# EAGLE design PICrouter (EAGLE 6.2)

## Sheet 1 of 3
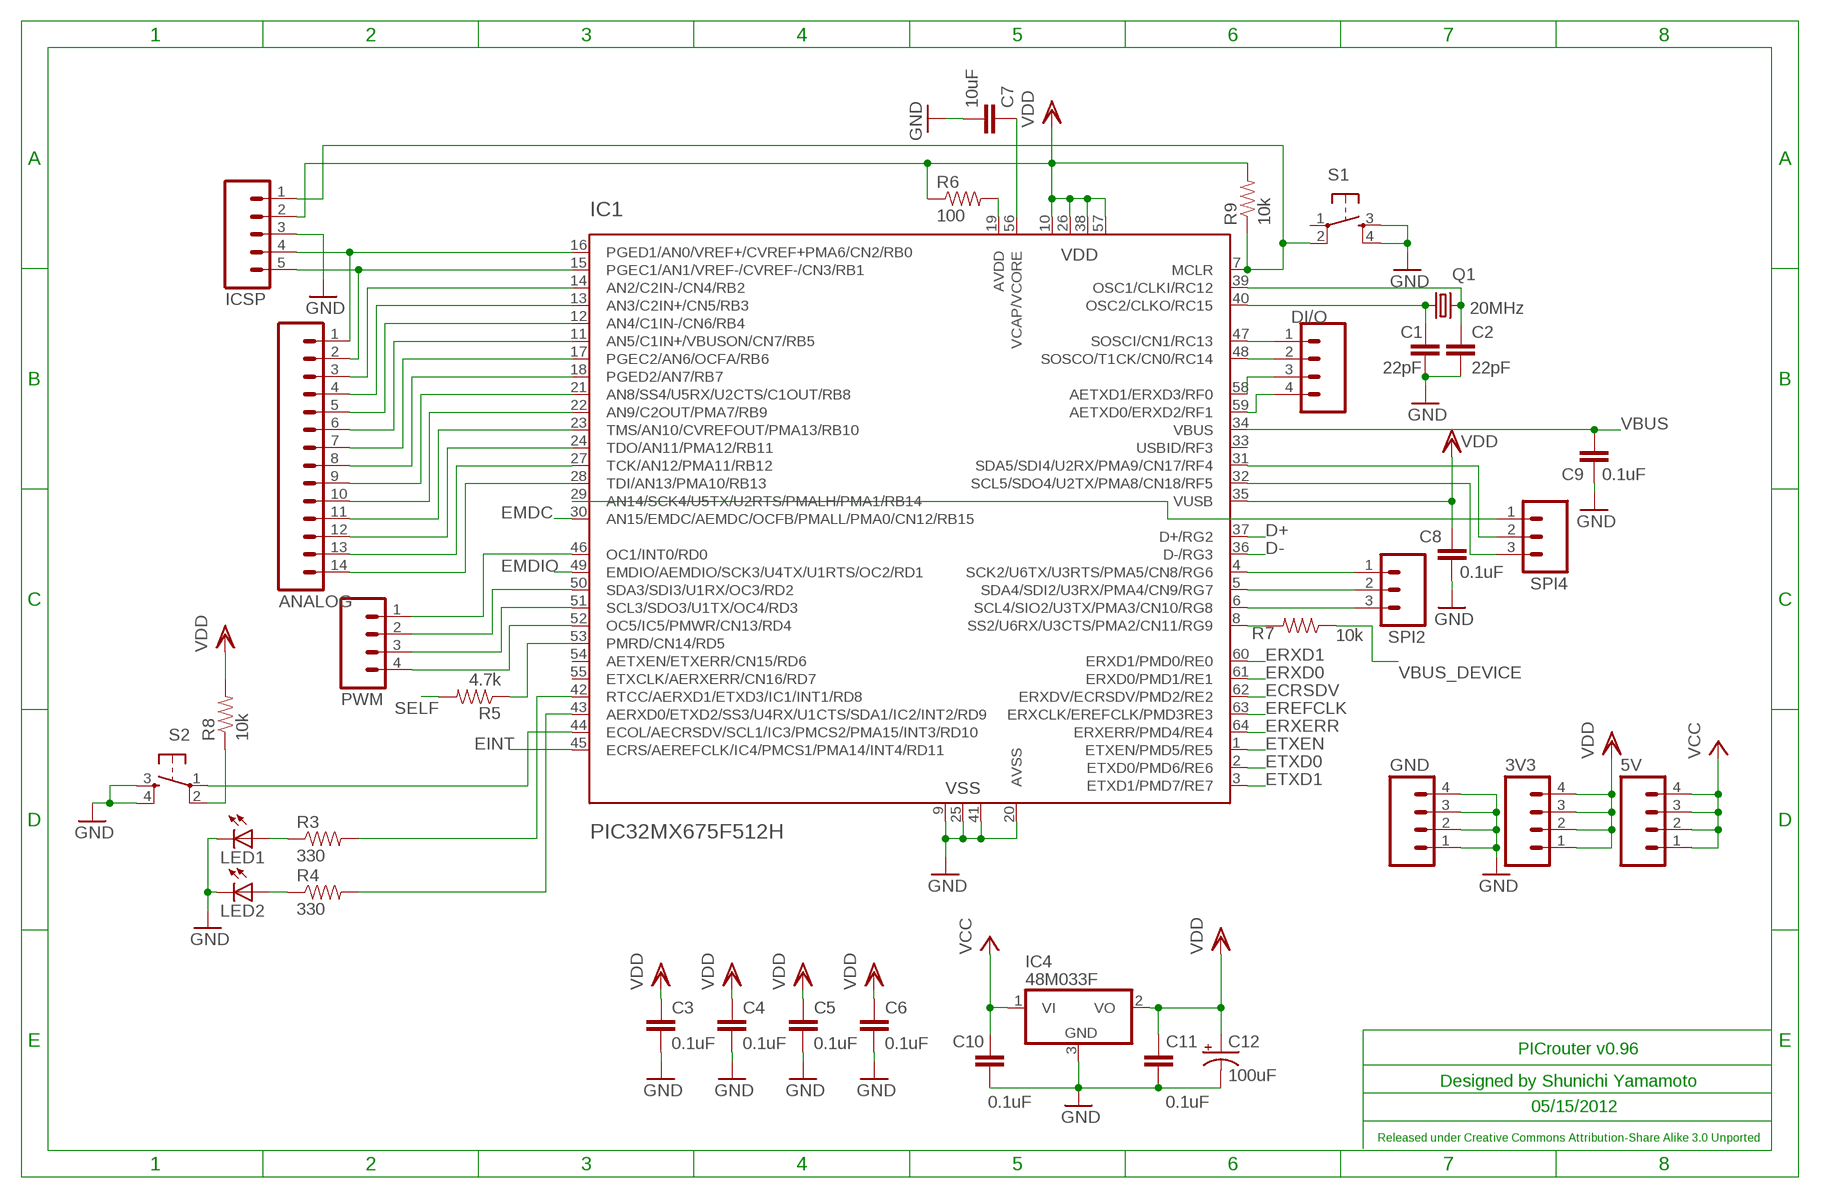
[diagram p0: schematic, sheet 1]

### Parts
3V3  M04PTH  [1X04]
5V  M04PTH  [1X04]
ANALOG  M14  [1X14]
C1  22pF  C-EUC2012  [C2012]
C2  22pF  C-EUC2012  [C2012]
C3  0.1uF  C-EUC2012  [C2012]
C4  0.1uF  C-EUC2012  [C2012]
C5  0.1uF  C-EUC2012  [C2012]
C6  0.1uF  C-EUC2012  [C2012]
C7  10uF  C-EUC2012  [C2012]
C8  0.1uF  C-EUC2012  [C2012]
C9  0.1uF  C-EUC2012  [C2012]
C10  0.1uF  C-EUC2012  [C2012]
C11  0.1uF  C-EUC2012  [C2012]
C12  100uF  CPOL-USC  [PANASONIC_C]
DI/O  M04PTH  [1X04]
GND  M04PTH  [1X04]
IC1  PIC32MX675F512H  [TQFP64-10X10]
IC4  48M033F  7805DT  [TO252]
ICSP  M05PTH  [1X05]
LED1  LEDCHIP-LED0603  [CHIP-LED0603]
LED2  LEDCHIP-LED0603  [CHIP-LED0603]
PWM  M04PTH  [1X04]
Q1  20MHz  CRYSTAL  [CTS406]
R3  330  RESISTOR0603-RES  [0603-RES]
R4  330  RESISTOR0603-RES  [0603-RES]
R5  4.7k  RESISTOR0603-RES  [0603-RES]
R6  100  RESISTOR0603-RES  [0603-RES]
R7  10k  RESISTOR0603-RES  [0603-RES]
R8  10k  RESISTOR0603-RES  [0603-RES]
R9  10k  RESISTOR0603-RES  [0603-RES]
S1  TAC_SWITCHSMD  [TACTILE_SWITCH_SMD]
S2  TAC_SWITCHSMD  [TACTILE_SWITCH_SMD]
SPI2  M03PTH  [1X03]
SPI4  M03PTH  [1X03]

### Nets
D+: IC1.37(D+/RG2) ; also sheet 3
D-: IC1.36(D-/RG3) ; also sheet 3
ECRSDV: IC1.62(ERXDV/ECRSDV/PMD2/RE2) ; also sheet 2
EINT: IC1.45(ECRS/AEREFCLK/IC4/PMCS1/PMA14/INT4/RD11) ; also sheet 2
EMDC: IC1.30(AN15/EMDC/AEMDC/OCFB/PMALL/PMA0/CN12/RB15) ; also sheet 2
EMDIO: IC1.49(EMDIO/AEMDIO/SCK3/U4TX/U1RTS/OC2/RD1) ; also sheet 2
EREFCLK: IC1.63(ERXCLK/EREFCLK/PMD3RE3) ; also sheet 2
ERXD0: IC1.61(ERXD0/PMD1/RE1) ; also sheet 2
ERXD1: IC1.60(ERXD1/PMD0/RE0) ; also sheet 2
ERXERR: IC1.64(ERXERR/PMD4/RE4) ; also sheet 2
ETXD0: IC1.2(ETXD0/PMD6/RE6) ; also sheet 2
ETXD1: IC1.3(ETXD1/PMD7/RE7) ; also sheet 2
ETXEN: IC1.1(ETXEN/PMD5/RE5) ; also sheet 2
GND: C1.2 C2.2 C3.2 C4.2 C5.2 C6.2 C7.2 C8.2 C9.1 C10.2 C11.2 C12.- GND.1 GND.2 GND.3 GND.4 IC1.9(GND) IC1.20(AVSS) IC1.25(GND) IC1.41(GND) IC4.3(GND) ICSP.3 LED1.C LED2.C S1.3 S1.4 S2.3 S2.4 ; also sheet 2,3
N$1: C2.1 IC1.39(OSC1/CLKI/RC12) Q1.3
N$2: C1.1 IC1.40(OSC2/CLKO/RC15) Q1.1
N$3: ANALOG.2 IC1.15(PGEC1/AN1/VREF-/CVREF-/CN3/RB1) ICSP.5
N$4: ANALOG.1 IC1.16(PGED1/AN0/VREF+/CVREF+PMA6/CN2/RB0) ICSP.4
N$6: IC1.7(MCLR) ICSP.1 R9.1 S1.2
N$7: C7.1 IC1.56(VCAP/VCORE)
N$8: R8.1 S2.2
N$10: IC1.19(AVDD) R6.2
N$11: IC1.53(PMRD/CN14/RD5) R5.1
N$12: IC1.8(SS2/U6RX/U3CTS/PMA2/CN11/RG9) R7.2
N$13: IC1.42(RTCC/AERXD1/ETXD3/IC1/INT1/RD8) R3.2
N$14: IC1.43(AERXD0/ETXD2/SS3/U4RX/U1CTS/SDA1/IC2/INT2/RD9) R4.2
N$15: LED1.A R3.1
N$16: LED2.A R4.1
N$17: IC1.44(ECOL/AECRSDV/SCL1/IC3/PMCS2/PMA15/INT3/RD10) S2.1
N$18: ANALOG.3 IC1.14(AN2/C2IN-/CN4/RB2)
N$19: ANALOG.4 IC1.13(AN3/C2IN+/CN5/RB3)
N$20: ANALOG.5 IC1.12(AN4/C1IN-/CN6/RB4)
N$21: ANALOG.6 IC1.11(AN5/C1IN+/VBUSON/CN7/RB5)
N$22: ANALOG.7 IC1.17(PGEC2/AN6/OCFA/RB6)
N$23: ANALOG.8 IC1.18(PGED2/AN7/RB7)
N$24: ANALOG.9 IC1.21(AN8/SS4/U5RX/U2CTS/C1OUT/RB8)
N$25: ANALOG.10 IC1.22(AN9/C2OUT/PMA7/RB9)
N$26: ANALOG.11 IC1.23(TMS/AN10/CVREFOUT/PMA13/RB10)
N$27: ANALOG.12 IC1.24(TDO/AN11/PMA12/RB11)
N$28: ANALOG.13 IC1.27(TCK/AN12/PMA11/RB12)
N$29: ANALOG.14 IC1.28(TDI/AN13/PMA10/RB13)
N$30: IC1.4(SCK2/U6TX/U3RTS/PMA5/CN8/RG6) SPI2.1
N$31: IC1.5(SDA4/SDI2/U3RX/PMA4/CN9/RG7) SPI2.2
N$32: IC1.6(SCL4/SIO2/U3TX/PMA3/CN10/RG8) SPI2.3
N$33: IC1.31(SDA5/SDI4/U2RX/PMA9/CN17/RF4) SPI4.2
N$34: IC1.32(SCL5/SDO4/U2TX/PMA8/CN18/RF5) SPI4.3
N$35: IC1.29(AN14/SCK4/U5TX/U2RTS/PMALH/PMA1/RB14) SPI4.1
N$36: IC1.46(OC1/INT0/RD0) PWM.1
N$37: DI/O.1 IC1.47(SOSCI/CN1/RC13)
N$38: IC1.50(SDA3/SDI3/U1RX/OC3/RD2) PWM.2
N$39: IC1.51(SCL3/SDO3/U1TX/OC4/RD3) PWM.3
N$40: IC1.52(OC5/IC5/PMWR/CN13/RD4) PWM.4
N$41: DI/O.2 IC1.48(SOSCO/T1CK/CN0/RC14)
N$42: DI/O.3 IC1.58(AETXD1/ERXD3/RF0)
N$43: DI/O.4 IC1.59(AETXD0/ERXD2/RF1)
SELF: R5.2 ; also sheet 3
VBUS: C9.2 IC1.34(VBUS) ; also sheet 3
VBUS_DEVICE: R7.1 ; also sheet 3
VCC: 5V.1 5V.2 5V.3 5V.4 C10.1 IC4.1(VI) ; also sheet 3
VDD: 3V3.1 3V3.2 3V3.3 3V3.4 C3.1 C4.1 C5.1 C6.1 C8.1 C11.1 C12.+ IC1.10(VDD) IC1.26(VDD) IC1.35(VUSB) IC1.38(VDD) IC1.57(VDD) IC4.2(VO) ICSP.2 R6.1 R8.2 R9.2 ; also sheet 2
Unconnected: IC1.33(USBID/RF3) IC1.54(AETXEN/ETXERR/CN15/RD6) IC1.55(ETXCLK/AERXERR/CN16/RD7) S1.1

### Notes on the sheet
- PICrouter v0.96
- Designed by Shunichi Yamamoto
- 05/15/2012
- Released under Creative Commons Attribution-Share Alike 3.0 Unported

## Sheet 2 of 3
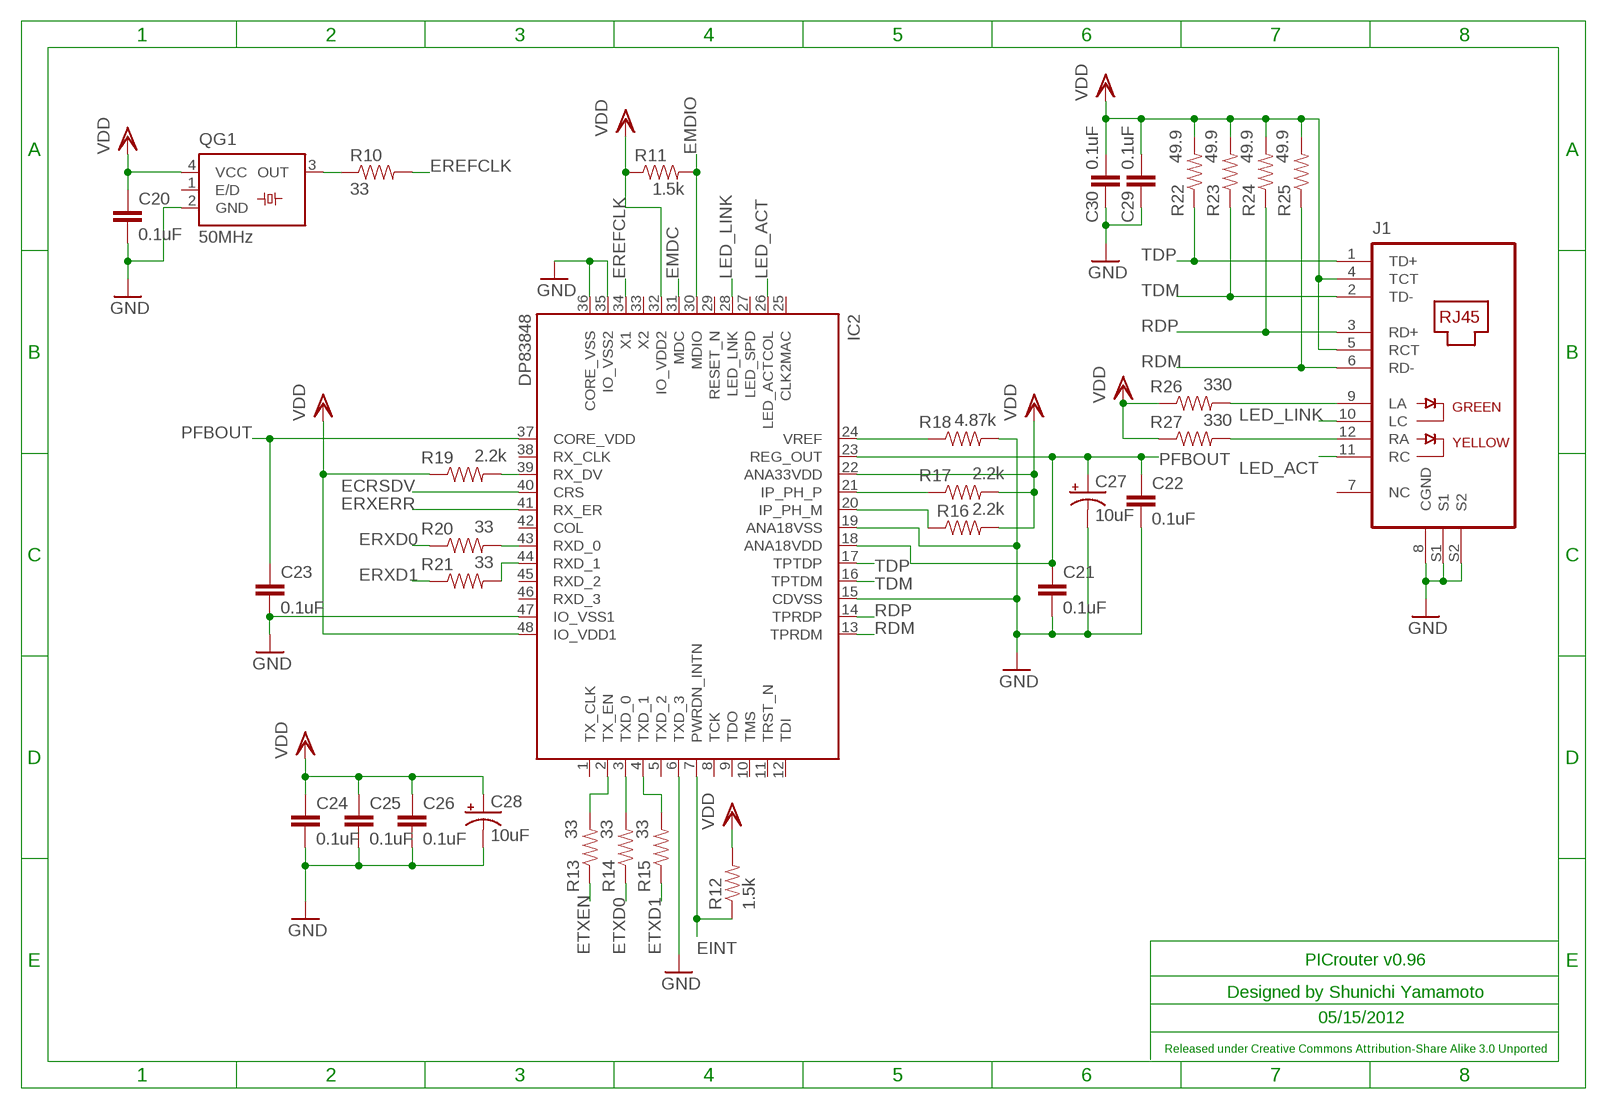
[diagram p1: schematic, sheet 2]

### Parts
C20  0.1uF  C-EUC2012  [C2012]
C21  0.1uF  C-EUC2012  [C2012]
C22  0.1uF  C-EUC2012  [C2012]
C23  0.1uF  C-EUC2012  [C2012]
C24  0.1uF  C-EUC2012  [C2012]
C25  0.1uF  C-EUC2012  [C2012]
C26  0.1uF  C-EUC2012  [C2012]
C27  10uF  CAP_POL6032  [EIA6032]
C28  10uF  CPOL-USC  [PANASONIC_C]
C29  0.1uF  C-EUC2012  [C2012]
C30  0.1uF  C-EUC2012  [C2012]
IC2  DP83848  [LQFP48]
J1  J0011  [PJ-J0]
QG1  50MHz  SM77H  [SM77H]
R10  33  RESISTOR0603-RES  [0603-RES]
R11  1.5k  RESISTOR0603-RES  [0603-RES]
R12  1.5k  RESISTOR0603-RES  [0603-RES]
R13  33  RESISTOR0603-RES  [0603-RES]
R14  33  RESISTOR0603-RES  [0603-RES]
R15  33  RESISTOR0603-RES  [0603-RES]
R16  2.2k  RESISTOR0603-RES  [0603-RES]
R17  2.2k  RESISTOR0603-RES  [0603-RES]
R18  4.87k  RESISTOR0603-RES  [0603-RES]
R19  2.2k  RESISTOR0603-RES  [0603-RES]
R20  33  RESISTOR0603-RES  [0603-RES]
R21  33  RESISTOR0603-RES  [0603-RES]
R22  49.9  RESISTOR0603-RES  [0603-RES]
R23  49.9  RESISTOR0603-RES  [0603-RES]
R24  49.9  RESISTOR0603-RES  [0603-RES]
R25  49.9  RESISTOR0603-RES  [0603-RES]
R26  330  RESISTOR0603-RES  [0603-RES]
R27  330  RESISTOR0603-RES  [0603-RES]

### Nets
ECRSDV: IC2.40(CRS) ; also sheet 1
EINT: IC2.7(PWRDN_INTN) R12.1 ; also sheet 1
EMDC: IC2.31(MDC) ; also sheet 1
EMDIO: IC2.30(MDIO) R11.2 ; also sheet 1
EREFCLK: IC2.34(X1) R10.2 ; also sheet 1
ERXD0: R20.1 ; also sheet 1
ERXD1: R21.1 ; also sheet 1
ERXERR: IC2.41(RX_ER) ; also sheet 1
ETXD0: R14.1 ; also sheet 1
ETXD1: R15.1 ; also sheet 1
ETXEN: R13.1 ; also sheet 1
GND: C20.2 C21.2 C22.2 C23.2 C24.2 C25.2 C26.2 C27.P$2(-) C28.- C29.2 C30.2 IC2.6(TXD_3) IC2.15(CDVSS) IC2.19(ANA18VSS) IC2.35(IO_VSS2) IC2.36(CORE_VSS) IC2.47(IO_VSS1) J1.8(CGND) J1.S1 J1.S2 QG1.2(GND) R18.2 ; also sheet 1,3
LED_ACT: IC2.26(LED_ACTCOL) J1.11(RC)
LED_LINK: IC2.28(LED_LNK) J1.10(LC)
N$9: IC2.24(VREF) R18.1
N$47: IC2.21(IP_PH_P) R17.1
N$48: IC2.20(IP_PH_M) R16.1
N$49: IC2.39(RX_DV) R19.2
N$52: IC2.4(TXD_1) R15.2
N$53: IC2.3(TXD_0) R14.2
N$54: IC2.2(TX_EN) R13.2
N$55: J1.9(LA) R26.2
N$56: IC2.43(RXD_0) R20.2
N$57: IC2.44(RXD_1) R21.2
N$58: QG1.3(OUT) R10.1
N$62: J1.12(RA) R27.2
PFBOUT: C21.1 C22.1 C23.1 C27.P$1(+) IC2.18(ANA18VDD) IC2.23(REG_OUT) IC2.37(CORE_VDD)
RDM: IC2.13(TPRDM) J1.6(RD-) R25.1
RDP: IC2.14(TPRDP) J1.3(RD+) R24.1
TDM: IC2.16(TPTDM) J1.2(TD-) R23.1
TDP: IC2.17(TPTDP) J1.1(TD+) R22.1
VDD: C20.1 C24.1 C25.1 C26.1 C28.+ C29.1 C30.1 IC2.22(ANA33VDD) IC2.32(IO_VDD2) IC2.48(IO_VDD1) J1.4(TCT) J1.5(RCT) QG1.4(VCC) R11.1 R12.2 R16.2 R17.2 R19.1 R22.2 R23.2 R24.2 R25.2 R26.1 R27.1 ; also sheet 1
Unconnected: IC2.1(TX_CLK) IC2.5(TXD_2) IC2.8(TCK) IC2.9(TDO) IC2.10(TMS) IC2.11(TRST_N) IC2.12(TDI) IC2.25(CLK2MAC) IC2.27(LED_SPD) IC2.29(RESET_N) IC2.33(X2) IC2.38(RX_CLK) IC2.42(COL) IC2.45(RXD_2) IC2.46(RXD_3) J1.7(NC) QG1.1(E/D)

### Notes on the sheet
- PICrouter v0.96
- Designed by Shunichi Yamamoto
- 05/15/2012
- Released under Creative Commons Attribution-Share Alike 3.0 Unported

## Sheet 3 of 3
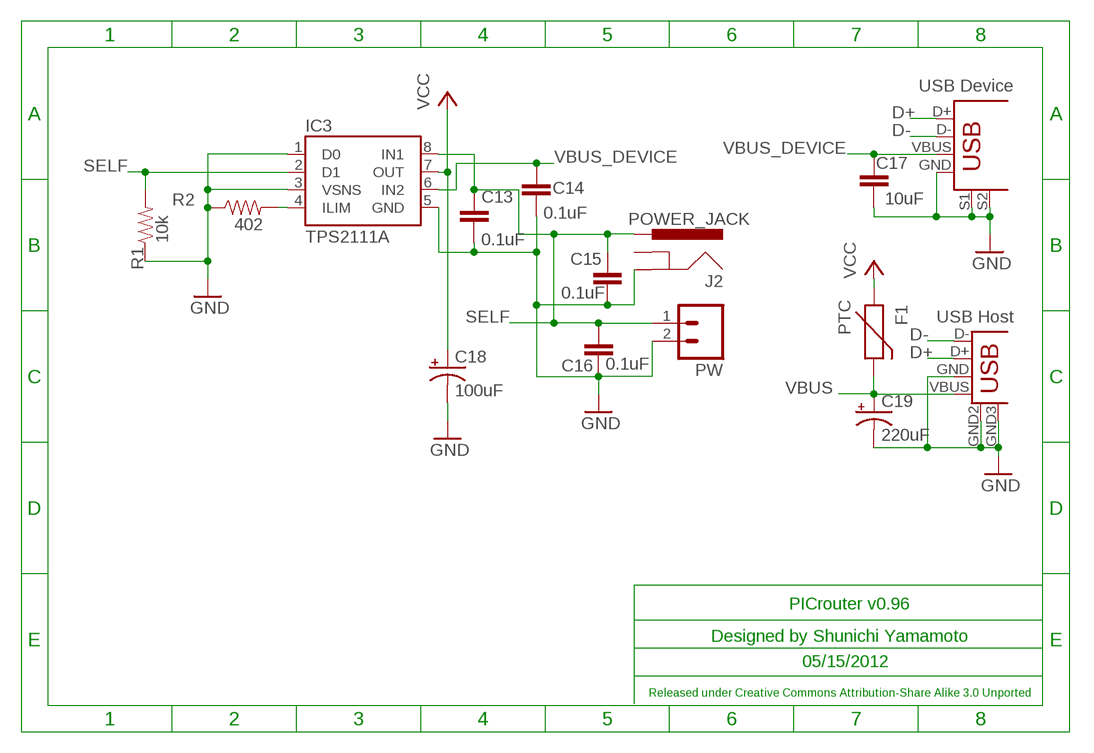
[diagram p2: schematic, sheet 3]

### Parts
C13  0.1uF  C-EUC2012  [C2012]
C14  0.1uF  C-EUC2012  [C2012]
C15  0.1uF  C-EUC2012  [C2012]
C16  0.1uF  C-EUC2012  [C2012]
C17  10uF  C-EUC2012  [C2012]
C18  100uF  CPOL-USC  [PANASONIC_C]
C19  220uF  CPOL-USD  [PANASONIC_D]
F1  PTC  PTCSMD  [PTC-1206]
IC3  TPS2111A  [TSSOP8]
J2  POWER_JACK  POWER_JACKPTH_LOCK  [POWER_JACK_PTH_LOCK]
PW  M02PTH  [1X02]
R1  10k  RESISTOR0603-RES  [0603-RES]
R2  402  RESISTOR0603-RES  [0603-RES]
U2  DEVICE  USB+SHIELD  [USB-B-PTH]
X2  USB-A-H  [USB-A-H]

### Nets
D+: U2.D+ X2.D+ ; also sheet 1
D-: U2.D- X2.D- ; also sheet 1
GND: C13.2 C14.2 C15.2 C16.2 C17.2 C18.- C19.- IC3.1(D0) IC3.3(VSNS) IC3.5(GND) J2.GND PW.2 R1.1 R2.1 U2.GND U2.S1 U2.S2 X2.GND X2.GND2(S1) X2.GND3(S2) ; also sheet 1,2
N$61: IC3.4(ILIM) R2.2
SELF: C13.1 C15.1 C16.1 IC3.2(D1) IC3.8(IN1) J2.PWR PW.1 R1.2 ; also sheet 1
VBUS: C19.+ F1.2 X2.VBUS ; also sheet 1
VBUS_DEVICE: C14.1 C17.1 IC3.6(IN2) U2.VBUS ; also sheet 1
VCC: C18.+ F1.1 IC3.7(OUT) ; also sheet 1
Unconnected: J2.GNDBREAK

### Notes on the sheet
- USB Device
- USB Host
- PICrouter v0.96
- Designed by Shunichi Yamamoto
- 05/15/2012
- Released under Creative Commons Attribution-Share Alike 3.0 Unported

## Library data of the parts
3V3 5V DI/O GND PWM = SparkFun:M04: Header 4 Standard 4-pin 0.1" header. Use with straight break away headers (SKU : PRT-00116), right angle break away headers (PRT-00553), swiss pins (PRT-00743), machine pins (PRT-00117), and female headers (PRT-00115). Molex polarized connector foot print use with SKU : PRT-08231 with associated crimp pins and housings. 1MM SMD Version SKU: PRT-10208
ANALOG = SparkFun:M14: Header 14 Standard 14-pin 0.1" header. Use with straight break away headers (SKU : PRT-00116), right angle break away headers (PRT-00553), swiss pins (PRT-00743), machine pins (PRT-00117), and female headers (PRT-00115).
C1-C11 C13-C17 C20-C26 C29 C30 = rcl:C-EU: CAPACITOR, European symbol
C12 C18 C19 C28 = rcl:CPOL-US: POLARIZED CAPACITOR, American symbol
C27 = SparkFun:CAP_POL: Capacitor Polarized These are standard SMD and PTH capacitors. Normally 10uF, 47uF, and 100uF in electrolytic and tantalum varieties. Always verify the external diameter of the through hole cap, it varies with capacity, voltage, and manufacturer. The EIA devices should be standard.
F1 = SparkFun:PTC: Resettable Fuse PTC Resettable Fuse. Spark Fun Electronics SKU : COM-08357
IC1 = PIC.rpt:PIC32MX675F512H: Microchip PIC32 USB
IC2 = national-semiconductor:DP83848: PHYTER® - Extended Temperature Single Port 10/100 Mb/s Ethernet Physical Layer Transceiver Auto generated by make-symbol-device-package-bsdl.ulp Rev. 34 Source: dp83848yb.bsdl http://www.national.com/ds/DP/DP83848VYB.pdf; MPN: DP83848VYB; OC_FARNELL: 1286817; OC_NEWARK: 11N4484
IC3 = SparkFun:TPS2111A
IC4 = linear:78*: Positive VOLTAGE REGULATOR Source: http://cache.national.com/ds/LM/LM78L05.pdf http://www.fairchildsemi.com/ds/LM/LM7805.pdf
ICSP = SparkFun:M05: Header 5 Standard 5-pin 0.1" header. Use with straight break away headers (SKU : PRT-00116), right angle break away headers (PRT-00553), swiss pins (PRT-00743), machine pins (PRT-00117), and female headers (PRT-00115). Molex polarized connector foot print use with SKU : PRT-08230 with associated crimp pins and housings.
J1 = pulse_j0011:J0011: RJ45 PulseJack w/LEDs
J2 = SparkFun:POWER_JACK: Power Jack This is the standard 5.5mm barrel jack for power. The PTH is the most common, proven, reliable, footprint. All others are experimental. The Slot footprint only works if the mill layer is transmitted to the PCB fab house so be warned. Spark Fun Electronics SKU : PRT-00119. Mating wall wart : TOL-00298 (and others)
LED1 LED2 = led:LED: LED OSRAM: - CHIPLED LG R971, LG N971, LY N971, LG Q971, LY Q971, LO R971, LY R971 LH N974, LH R974 LS Q976, LO Q976, LY Q976 LO Q996 - Hyper CHIPLED LW Q18S LB Q993, LB Q99A, LB R99A - SideLED LS A670, LO A670, LY A670, LG A670, LP A670 LB A673, LV A673, LT A673, LW A673 LH A674 LY A675 LS A676, LA A676, LO A676, LY A676, LW A676 LS A679, LY A679, LG A679 - Hyper Micro SIDELED® LS Y876, LA Y876, LO Y876, LY Y876 LT Y87S - SmartLED LW L88C, LW L88S LB L89C, LB L89S, LG L890 LS L89K, LO L89K, LY L89K LS L896, LA L896, LO L896, LY L896 - TOPLED LS T670, LO T670, LY T670, LG T670, LP T670 LSG T670, LSP T670, LSY T670, LOP T670, LYG T670 LG T671, LOG T671, LSG T671 LB T673, LV T673, LT T673, LW T673 LH T674 LS T676, LA T676, LO T676, LY T676, LB T676, LH T676, LSB T676, LW T676 LB T67C, LV T67C, LT T67C, LS T67K, LO T67K, LY T67K, LW E67C LS E67B, LA E67B, LO E67B, LY E67B, LB E67C, LV E67C, LT E67C LW T67C LS T679, LY T679, LG T679 LS T770, LO T770, LY T770, LG T770, LP T770 LB T773, LV T773, LT T773, LW T773 LH T774 LS E675, LA E675, LY E675, LS T675 LS T776, LA T776, LO T776, LY T776, LB T776 LHGB T686 LT T68C, LB T68C - Hyper Mini TOPLED® LB M676 - Mini TOPLED Santana® LG M470 LS M47K, LO M47K, LY M47K Source: http://www.osram.convergy.de LUXEON: - LUMILED® LXK2-PW12-R00, LXK2-PW12-S00, LXK2-PW14-U00, LXK2-PW14-V00 LXK2-PM12-R00, LXK2-PM12-S00, LXK2-PM14-U00 LXK2-PE12-Q00, LXK2-PE12-R00, LXK2-PE12-S00, LXK2-PE14-T00, LXK2-PE14-U00 LXK2-PB12-K00, LXK2-PB12-L00, LXK2-PB12-M00, LXK2-PB14-N00, LXK2-PB14-P00, LXK2-PB14-Q00 LXK2-PR12-L00, LXK2-PR12-M00, LXK2-PR14-Q00, LXK2-PR14-R00 LXK2-PD12-Q00, LXK2-PD12-R00, LXK2-PD12-S00 LXK2-PH12-R00, LXK2-PH12-S00 LXK2-PL12-P00, LXK2-PL12-Q00, LXK2-PL12-R00 Source: www.luxeon.com KINGBRIGHT: KA-3528ASYC Source: www.kingbright.com
PW = SparkFun:M02: Header 2 Standard 2-pin 0.1" header. Use with straight break away headers (SKU : PRT-00116), right angle break away headers (PRT-00553), swiss pins (PRT-00743), machine pins (PRT-00117), and female headers (PRT-00115). Molex polarized connector foot print use with SKU : PRT-08233 with associated crimp pins and housings.
Q1 = my-crystal:CRYSTAL: CRYSTAL
QG1 = my-crystal:SM77H: 3.3V CMOS Clock Oscillator Source: www.pletronics.com .. sm77h%203.3v.pdf; OC_FARNELL: unknown; OC_NEWARK: unknown
R1-R27 = SparkFun:RESISTOR: Resistor Basic schematic elements and footprints for 0603, 1206, and PTH resistors.
S1 S2 = SparkFun:TAC_SWITCH: Momentary Switch Button commonly used for reset or general input. Spark Fun Electronics SKU : COM-00097
SPI2 SPI4 = SparkFun:M03: Header 3 Standard 3-pin 0.1" header. Use with straight break away headers (SKU : PRT-00116), right angle break away headers (PRT-00553), swiss pins (PRT-00743), machine pins (PRT-00117), and female headers (PRT-00115). Molex polarized connector foot print use with SKU : PRT-08232 with associated crimp pins and housings.
U2 = SparkFun:USB+SHIELD: USB+Shield USB connector with shield pins connectable
X2 = SparkFun:USB: USB Connectors USB-B-PTH is fully proven SKU : PRT-00139 USB-miniB is fully proven SKU : PRT-00587 USB-A-PCB is untested. USB-A-H is throughly reviewed, but untested. Spark Fun Electronics SKU : PRT-00437 USB-B-SMT is throughly reviewed, but untested. Needs silkscreen touching up. USB-A-S has not been used/tested USB-MB-H has not been used/tested

## Board
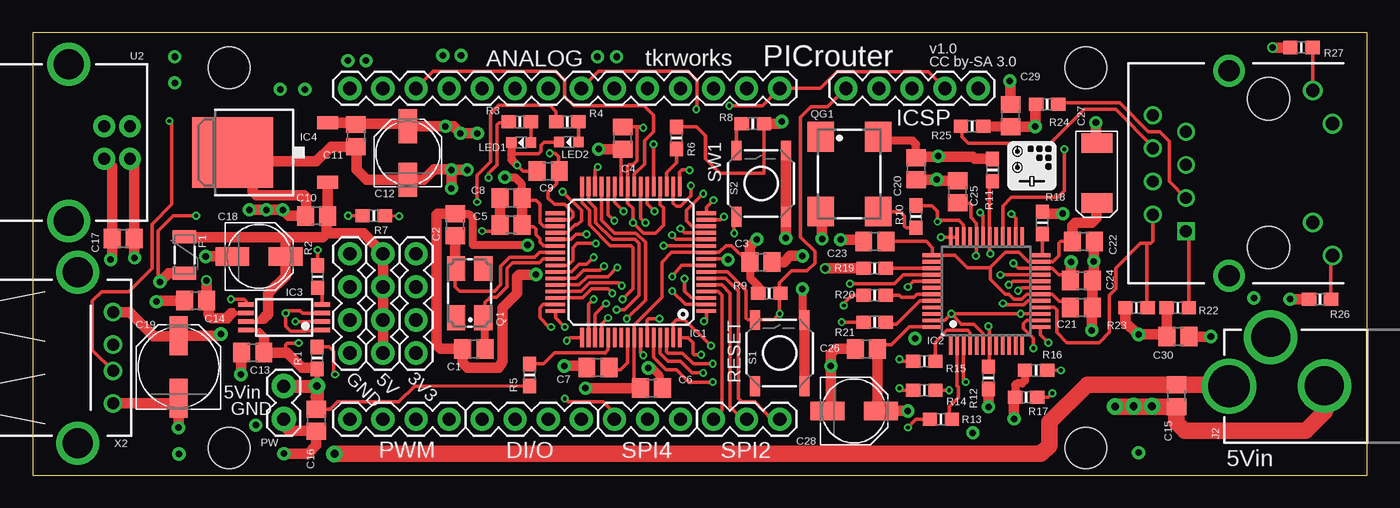
[diagram p3: board, top side]
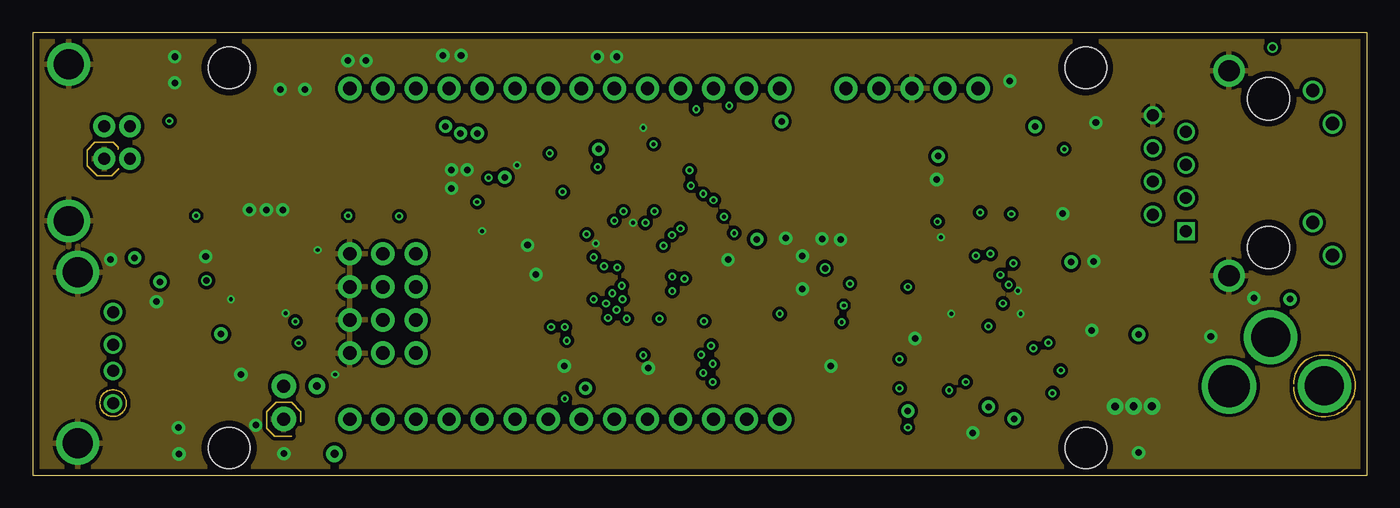
[diagram p4: board, inner layer GND]
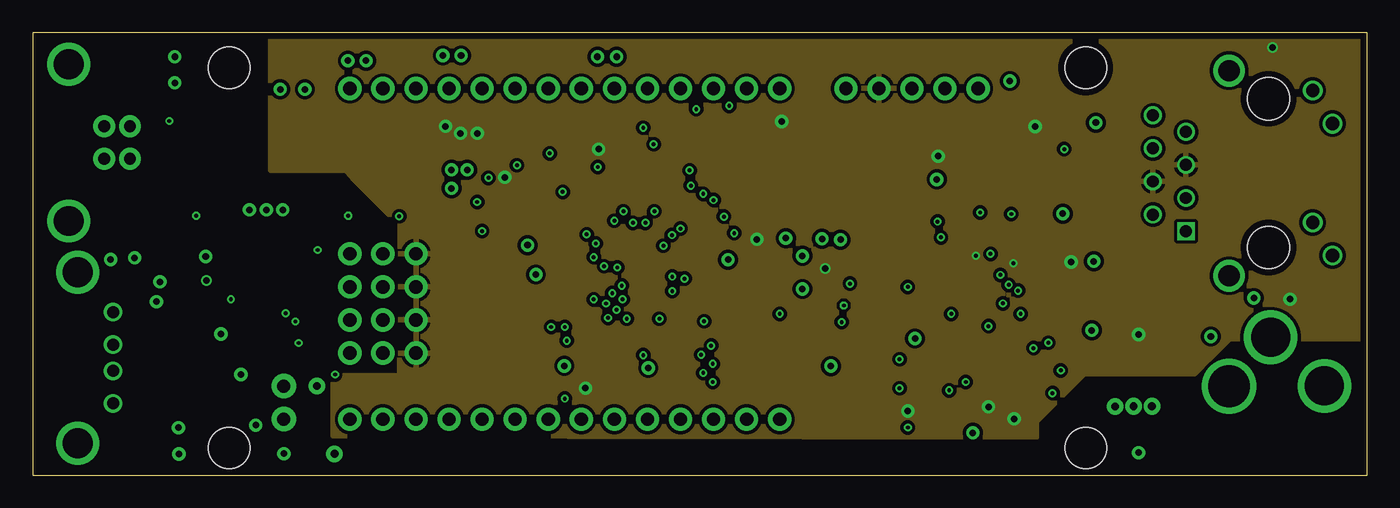
[diagram p5: board, inner layer VDD]
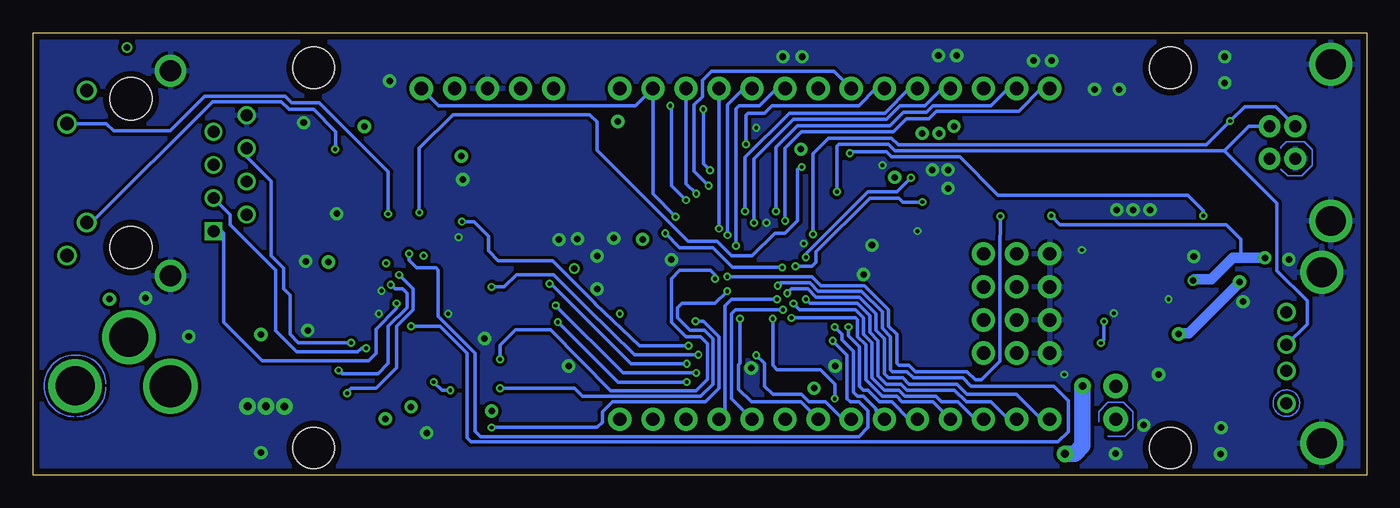
[diagram p6: board, bottom side, seen from below]

Size 102.5 x 34 mm. Coordinates in mm from the lower left corner, seen from the top.
Outline: 102.5,34 0,34 0,0 102.5,0 102.5,34
Copper layers (1+2*15+16): Top 0.018mm / dielectric 0.25mm / GND 0.035mm / dielectric 1mm / Route15 0.035mm / dielectric 0.25mm / Bottom 0.018mm
Design rules: minimum track width 5mil, minimum drill 0.3mm, track to track 5mil, track to pad 0.229mm, pad to pad 5mil, via to via 5mil, smd to smd 5mil, copper to edge 0.5mm, drill to drill 0.5mm, minimum pad ring 0.15mm, minimum via ring 0.15mm, stop-mask expansion 4mil, vias tented up to drill 0.35mm, thermal gap 10mil
Holes 3.2 mm at 15.1,31.3 15.1,2.1 80.9,2.1 80.9,31.3

### Footprints (pad centres in the part's own frame; a part is rotated, then mirrored left to right if it is on the bottom)
1X04 = drill 1.016 pad 1.778: 1 0,0; 2 2.54,0; 3 5.08,0; 4 7.62,0
1X14 = drill 1.016 pad 1.778: 1 0,0; 2 2.54,0; 3 5.08,0; 4 7.62,0; 5 10.16,0; 6 12.7,0; 7 15.24,0; 8 17.78,0; 9 20.32,0; 10 22.86,0; 11 25.4,0; 12 27.94,0; 13 30.48,0; 14 33.02,0
C2012 = smd 1.3 x 1.5: 1 -0.85,0; 2 0.85,0
PANASONIC_C = smd 2.6 x 1.4: + 2.05,0; - -2.05,0
PANASONIC_D = smd 3 x 1.4: + 2.4,0; - -2.4,0
EIA6032 = smd 1.5 x 2.4: P$1 -2.3,0; P$2 2.3,0
PTC-1206 = smd 1 x 1.8: 1 -1.4,0; 2 1.4,0
TQFP64-10X10 = smd 1.5 x 0.28: 1 -5.8,3.75; 2 -5.8,3.25; 3 -5.8,2.75; 4 -5.8,2.25; 5 -5.8,1.75; 6 -5.8,1.25; 7 -5.8,0.75; 8 -5.8,0.25; 9 -5.8,-0.25; 10 -5.8,-0.75; 11 -5.8,-1.25; 12 -5.8,-1.75; 13 -5.8,-2.25; 14 -5.8,-2.75; 15 -5.8,-3.25; 16 -5.8,-3.75; 33 5.8,-3.75; 34 5.8,-3.25; 35 5.8,-2.75; 36 5.8,-2.25; 37 5.8,-1.75; 38 5.8,-1.25; 39 5.8,-0.75; 40 5.8,-0.25; 41 5.8,0.25; 42 5.8,0.75; 43 5.8,1.25; 44 5.8,1.75; 45 5.8,2.25; 46 5.8,2.75; 47 5.8,3.25; 48 5.8,3.75 | smd 0.28 x 1.5: 17 -3.75,-5.8; 18 -3.25,-5.8; 19 -2.75,-5.8; 20 -2.25,-5.8; 21 -1.75,-5.8; 22 -1.25,-5.8; 23 -0.75,-5.8; 24 -0.25,-5.8; 25 0.25,-5.8; 26 0.75,-5.8; 27 1.25,-5.8; 28 1.75,-5.8; 29 2.25,-5.8; 30 2.75,-5.8; 31 3.25,-5.8; 32 3.75,-5.8; 49 3.75,5.8; 50 3.25,5.8; 51 2.75,5.8; 52 2.25,5.8; 53 1.75,5.8; 54 1.25,5.8; 55 0.75,5.8; 56 0.25,5.8; 57 -0.25,5.8; 58 -0.75,5.8; 59 -1.25,5.8; 60 -1.75,5.8; 61 -2.25,5.8; 62 -2.75,5.8; 63 -3.25,5.8; 64 -3.75,5.8
LQFP48 = smd 1.5 x 0.279: 1 -4.15,2.75; 2 -4.15,2.25; 3 -4.15,1.75; 4 -4.15,1.25; 5 -4.15,0.75; 6 -4.15,0.25; 7 -4.15,-0.25; 8 -4.15,-0.75; 9 -4.15,-1.25; 10 -4.15,-1.75; 11 -4.15,-2.25; 12 -4.15,-2.75; 25 4.15,-2.75; 26 4.15,-2.25; 27 4.15,-1.75; 28 4.15,-1.25; 29 4.15,-0.75; 30 4.15,-0.25; 31 4.15,0.25; 32 4.15,0.75; 33 4.15,1.25; 34 4.15,1.75; 35 4.15,2.25; 36 4.15,2.75 | smd 0.279 x 1.5: 13 -2.75,-4.15; 14 -2.25,-4.15; 15 -1.75,-4.15; 16 -1.25,-4.15; 17 -0.75,-4.15; 18 -0.25,-4.15; 19 0.25,-4.15; 20 0.75,-4.15; 21 1.25,-4.15; 22 1.75,-4.15; 23 2.25,-4.15; 24 2.75,-4.15; 37 2.75,4.15; 38 2.25,4.15; 39 1.75,4.15; 40 1.25,4.15; 41 0.75,4.15; 42 0.25,4.15; 43 -0.25,4.15; 44 -0.75,4.15; 45 -1.25,4.15; 46 -1.75,4.15; 47 -2.25,4.15; 48 -2.75,4.15
TSSOP8 = smd 1.2 x 0.35: 1 -2.925,0.975; 2 -2.925,0.325; 3 -2.925,-0.325; 4 -2.925,-0.975; 5 2.925,-0.975; 6 2.925,-0.325; 7 2.925,0.325; 8 2.925,0.975
TO252 = smd 1 x 1.6: 1 -2.28,-4.8; 2 2.28,-4.8 | smd 5.4 x 6.2: 3 0,2.5
1X05 = drill 1.016 pad 1.778: 1 0,0; 2 2.54,0; 3 5.08,0; 4 7.62,0; 5 10.16,0
PJ-J0 = drill 0.914 square: 1 4.445,-6.35 | drill 0.914: 2 3.175,-8.89; 3 1.905,-6.35; 4 0.635,-8.89; 5 -0.635,-6.35; 6 -1.905,-8.89; 7 -3.175,-6.35; 8 -4.445,-8.89 | drill 1.016: 9 6.325,4.902; 10 3.785,3.378; 11 -3.81,4.902; 12 -6.35,3.378 | drill 1.626: S1 -7.874,-3.048; S2 7.874,-3.048 | hole 3.251: -5.715,0; 5.715,0
POWER_JACK_PTH_LOCK = drill 2.997 pad 4.115: GND 0.025,6.557; GNDBREAK 3.762,10.7 | drill 3.2 pad 4.115: PWR 0,13.878
CHIP-LED0603 = smd 0.8 x 0.8: A 0,-0.75; C 0,0.75
1X02 = drill 1.016 pad 1.88: 1 0,0; 2 2.54,0
CTS406 = smd 1.9 x 1.4: 1 -1.883,-1.041; 2 1.883,-1.041; 3 1.883,1.041; 4 -1.883,1.041
SM77H = smd 2.286 x 2.032: 1 -2.868,-2.217; 2 2.868,-2.217; 3 2.868,2.217; 4 -2.868,2.217
0603-RES = smd 1.1 x 1: 1 -0.85,0; 2 0.85,0
TACTILE_SWITCH_SMD = smd 1.524 x 0.762: 1 -2.54,1.905; 2 2.54,1.905; 3 -2.54,-1.905; 4 2.54,-1.905
1X03 = drill 1.016 pad 1.778: 1 0,0; 2 2.54,0; 3 5.08,0
USB-B-PTH = drill 0.914 pad 1.676: D+ 0,1.25; D- 1.981,1.25; GND 0,-1.25; VBUS 1.981,-1.25 | drill 2.286: S1 -2.718,-6.02; S2 -2.718,6.02
USB-A-H = drill 0.92 pad 1.422: D+ 2.71,-1; D- 2.71,1; GND 2.71,-3.5; VBUS 2.71,3.5 | drill 2.3: GND2 0,-6.57; GND3 0,6.57

### Placement (x,y rotation side)
3V3  29.45,17.01 270 top
5V  26.91,17.01 270 top
ANALOG  57.39,29.71 180 top
C1  33.9,9.71 180 top
C2  32.47,19.23 90 top
C3  55.96,16.37 0 top
C4  45.33,25.9 90 top
C5  36.75,19.23 180 top
C6  47.55,6.69 0 top
C7  43.42,8.28 180 top
C8  36.75,21.3 180 top
C9  39.61,23.36 0 top
C10  21.83,19.92 180 top
C11  24.85,26.09 270 top
C12  28.83,24.74 90 top
C13  16.92,9.42 180 top
C14  12.53,13.41 180 top
C15  87.86,6.12 270 top
C16  21.81,4.23 270 top
C17  6.97,18.19 180 top
C18  17.4,16.81 0 top
C19  11.22,8.31 90 top
C20  67.87,23.55 270 top
C21  80.57,12.88 0 top
C22  80.73,17.96 0 top
C23  64.69,17.96 180 top
C24  80.57,14.95 0 top
C25  71.04,21.77 90 top
C26  64.06,9.71 180 top
C27  81.75,23.21 90 top
C28  63.11,4.94 0 top
C29  75.12,27.63 90 top
C30  87.97,10.66 0 top
DI/O  34.53,4.31 0 top
F1  11.68,16.93 270 top
GND  24.37,17.01 270 top
IC1  45.96,16.37 180 top
IC2  73.27,14.15 90 top
IC3  19.32,12.13 180 top
IC4  17.86,24.79 90 top
ICSP  62.47,29.71 0 top
J1  94.95,23.2 270 top
J2  105.8,6.84 90 top
LED1  37.53,25.55 90 top
LED2  41.19,25.59 90 top
PW  19.29,6.85 270 top
PWM  24.37,4.31 0 top
Q1  33.58,13.99 90 top
QG1  62.74,23.12 270 top
R1  21.84,9.02 270 top
R2  21.9,15.26 270 top
R3  37.43,27.14 180 top
R4  41.08,27.14 180 top
R5  38.17,7.71 270 top
R6  49.45,25.9 270 top
R7  26.21,19.93 0 top
R8  55.33,27.01 0 top
R9  56.6,13.99 180 top
R10  67.87,19.87 90 top
R11  73.74,23.44 270 top
R12  73.43,7.48 270 top
R13  69.77,4.31 0 top
R14  68.5,6.53 0 top
R15  68.5,8.75 0 top
R16  77.08,8.06 180 top
R17  76.31,5.99 180 top
R18  77.55,19.39 90 top
R19  64.69,15.9 0 top
R20  64.69,13.83 0 top
R21  64.69,11.77 0 top
R22  87.97,12.88 180 top
R23  84.79,12.88 180 top
R24  77.93,28.5 180 top
R25  72.16,26.8 0 top
R26  98.89,13.52 0 top
R27  97.46,32.85 0 top
S1  57.39,9.39 90 top
S2  55.96,22.41 90 top
SPI2  52.31,4.31 0 top
SPI4  44.69,4.31 0 top
U2  5.5,25.55 0 top
U$1  [LOGO]  74.87,21.88 0 top
X2  3.47,9.03 0 top

### Tracks (layer width: path | path; a pad name or v marks a point on that pad's centre or on a via)
D+  (via drill 0.3, 0.3 pad 0.25)
  Top 0.254: v42.56,18.5 41.74,18.5 41.36,18.12 IC1.37 | v10.51,27.21 10.7,27.02 10.7,20.8 9.2,19.3 9.2,15.9 7.4,14.1 5.3,14.1 4.6,13.4 4.6,9.61 X2.D+
  Bottom 0.254: v42.56,18.5 42.56,24.69 41.36,25.9 36.52,25.9 36.01,25.38 12.34,25.38 v10.51,27.21 9.4,28.32 7.01,28.32 U2.D+
D-  (via drill 0.3 pad 0.25)
  Top 0.254: IC1.36 41.07,18.62 41.67,19.23 41.83,19.23 42.15,19.55 42.15,20.34 v40.72,21.77 | v40.72,21.77
  Bottom 0.254: v40.72,21.77 40.72,25.26 40.56,25.42 36.74,25.42 36.24,24.93 10.95,24.93 | 7.44,26.8 U2.D- 9.07,26.8 10.95,24.93 | 10.95,24.93 6.92,20.9 6.92,15.72 4.6,13.4 4.6,11.61 X2.D-
ECRSDV  (via drill 0.3)
  Top 0.254: IC1.62 48.71,9.5 48.82,9.39 49.93,9.39 50.76,8.56 v52.25,8.56 | IC2.40 66.9,15.4 66.22,14.72 v62.79,14.72
  Bottom 0.254: v62.79,14.72 62.69,14.72 56.55,8.58 52.39,8.58 v52.25,8.56
EINT  (via drill 0.3)
  Top 0.254: v73.42,11.45 73.52,11.36 IC2.7 73.52,8.43 R12.1 | IC1.45 42.12,14.12 42.79,14.79 45.01,14.79 45.17,14.63 v45.26,14.56
  Bottom 0.254: v73.42,11.45 71.2,11.45 69.14,9.39 69.14,2.88 68.82,2.56 23.74,2.56 22.94,3.36 22.94,5.74 24.05,6.85 30.4,6.85 31.04,7.48 34.85,7.48 35.33,7.96 36.44,7.96 36.59,8.12 36.59,10.66 37.23,11.29 37.23,12.56 38.82,14.15 42.15,14.15 42.79,14.79 45.04,14.79 v45.26,14.56
EMDC  (via drill 0.3)
  Top 0.254: IC1.30 43.21,23.47 v43.42,23.68 | IC2.31 73.02,19.96 v72.79,20.18
  Bottom 0.254: v72.79,20.18 72.79,25.11 70.19,27.7 59.7,27.7 59.14,27.14 59.14,24.95 52.15,17.96 49.93,17.96 48.82,16.85 47.23,16.85 45.48,18.6 44.69,18.6 43.74,19.55 43.74,23.52 43.58,23.68 v43.42,23.68
EMDIO  (via drill 0.3)
  Top 0.254: IC1.49 41.27,10.57 v41.04,10.34 | v73.58,17.01 73.52,17.08 IC2.30 73.52,22.36 R11.2 73.48,22.98 73.58,22.88
  Bottom 0.254: v41.04,10.34 39.93,9.23 39.93,5.9 39.67,5.64 39.04,5.64 38.34,4.94 38.34,3.67 39.04,2.98 68.09,2.98 68.5,3.39 68.5,9.39 71.33,12.21 71.33,15.74 71.52,15.93 72.98,15.93 73.58,16.53 v73.58,17.01
EREFCLK  (via drill 0.3)
  Top 0.254: IC1.63 49.21,11.69 49.45,11.93 50.09,11.93 v52.12,9.96 | IC2.34 71.52,19.23 71.17,19.58 69.61,19.58 v69.52,19.49 69.52,20.28 69.08,20.72 R10.2
  Bottom 0.254: v69.52,19.49 68.6,19.49 67.49,18.37 67.49,17.23 66.73,16.47 62.57,16.47 59.3,13.2 59.3,13.18 55.88,9.95 52.32,9.95 v52.12,9.96
ERXD0  (via drill 0.3)
  Top 0.254: IC1.61 48.21,9.36 48.82,8.75 49.77,8.75 50.66,7.87 v51.52,7.87 | v62.31,13.04 62.31,13.2 62.95,13.83 R20.1
  Bottom 0.254: v62.31,13.04 57.15,7.87 v51.52,7.87
ERXD1  (via drill 0.3)
  Top 0.254: IC1.60 47.71,9.07 48.66,8.12 49.45,8.12 50.41,7.17 v52.25,7.17 | R21.1 v62.15,11.77
  Bottom 0.254: v62.15,11.77 62.13,11.77 57.52,7.17 52.31,7.17 v52.25,7.17
ERXERR  (via drill 0.3)
  Top 0.254: IC1.64 50.33,10.57 50.72,10.18 50.72,9.36 50.82,9.26 v51.36,9.26 | v67.23,14.47 67.67,14.9 IC2.41
  Bottom 0.254: v67.23,14.47 66.28,14.47 65.33,15.42 62.47,15.42 59.93,12.88 56.25,9.27 v51.36,9.27 v51.36,9.26
ETXD0  (via drill 0.3)
  Top 0.254: IC1.2 50.16,13.12 v49.14,14.15 | R14.1 66.76,6.53 v66.6,6.69
  Bottom 0.254: v49.14,14.15 50.09,13.2 52.63,13.2 52.95,12.88 52.95,12.09 51.99,11.13 50.88,11.13 50.25,10.5 50.25,7.01 51.2,6.05 60.25,6.05 60.88,6.69 v66.6,6.69
ETXD1  (via drill 0.3)
  Top 0.254: IC1.3 50.62,13.62 50.09,14.15 v50.09,15.1 | R15.1 66.76,8.75 v66.6,8.91
  Bottom 0.254: v50.09,15.1 50.09,15.42 50.41,15.74 52.79,15.74 53.42,15.1 53.42,11.77 52.31,10.66 51.2,10.66 50.66,10.12 50.66,7.39 51.52,6.53 51.54,6.5 58.09,6.5 62.7,11.17 65.42,11.17 66.6,9.99 v66.6,8.91
ETXEN  (via drill 0.3)
  Top 0.254: IC1.1 51.76,12 v51.58,11.83 | R13.1 67.87,4.31 v67.23,3.67
  Bottom 0.254: v51.58,11.83 50.95,11.83 49.77,10.66 49.77,6.69 50.82,5.64 57.96,5.64 58.73,4.88 58.73,4.09 59.14,3.67 v67.23,3.67
GND  (via drill 0.3, 0.3 pad 0.25, 0.3 pad 0.6, 0.5 pad 1, 0.5 pad 1.02, 0.6 pad 1.27)
  Top 0.254: IC1.20 48.21,20.79 48.47,20.53 48.47,19.2 47.87,18.6 46.91,18.6 v46.12,19.39 46.12,20.5 45.71,20.91 IC1.25 45.71,23.74 45.8,23.84 46.12,23.84 46.44,24.15 46.44,26.69 | IC1.9 53.35,16.62 v53.42,16.57 | IC2.47 70.06,11.9 v70.57,12.4 | IC2.35 IC2.36 69.8,18.3 v69.77,18.28 | IC2.6 73.02,10.91 72.31,11.61 71.36,11.61 v70.57,12.4 | v70.57,12.4 71.52,12.4 IC2.15 | v34.53,18.75 35.74,18.75 C5.2 | C9.1 37.67,23.36 v37.21,23.81 | IC2.19 75.99,14.4 v75.7,14.18 | v46.91,26.69 46.86,26.75 46.49,26.75 46.44,26.69 | C4.2 46.38,26.75 46.44,26.69 | IC1.41 41.11,16.12 41.52,16.53 41.52,17.48 41.83,17.8 42.63,17.8 v43.26,17.8 | LED2.C 39.57,25.59 39.57,25.58 39.3,25.58 39.05,25.34 39.05,24.89 38.86,24.7 38.68,24.7 38.67,24.71 36.77,24.7 36.7,24.93 | IC3.3 22.23,12.45 20.77,12.45 20.57,12.64 19.62,12.64 v19.43,12.45 19.43,11.43 19.81,11.05 20.95,11.05 21.02,11.11 22.2,11.11 IC3.1 | R1.1 22.77,9.87 23.11,9.53 23.11,7.87 v23.24,7.75 | R2.1 21.88,16.11 v21.89,17.3 | IC3.5 16.39,13.39 16.26,13.53 v15.24,13.53
  Top 0.406: 16.01,9.54 16.07,9.54 C13.2
  Top 0.61: v59.14,14.31 59.14,12.09 S1.4 | C6.2 48.18,6.91 48.18,7.64 47.57,8.25 v47.3,8.24 | C2.2 33.49,20.07 33.8,19.79 33.8,17.7 38,17.7 v38.02,17.68 | LED1.C 36.78,24.9 36.77,24.7 36.79,24.25 v37.21,23.81 | 21,19.9 C10.2
  Top 0.813: C3.2 57.71,16.37 58.19,16.85 v59.14,16.85 | S2.4 S2.3 v57.87,18.22 v57.86,18.22 | S1.4 S1.3 59.3,6.7 | 63.84,18.17 C23.2 63.71,18.09 v62.07,18.09 | C25.2 69.56,22.62 v69.46,22.72 69.43,22.7 C20.2 | C8.2 C5.2 | C30.2 v90.51,10.66 | C2.2 31.09,20.08 31.04,20.02 31.04,10.02 31.36,9.71 C1.2 33.05,8.65 33.42,8.28 35.8,8.28 36.12,8.75 36.12,12.88 37.23,13.99 37.23,15.26 37.39,15.42 v38.66,15.42 | 16.76,24.09 17.07,24.09 17.1,24.12 21.8,24.12 22.92,25.24 C11.2 24.88,24.7 24.88,23.47 25.66,22.69 28.63,22.69 C12.- 30.04,22.69 30.85,23.5 32.14,23.5 v32.18,23.46 | 16.76,24.09 15.43,24.09 IC4.3 | C10.2 21.01,19.9 | C22.2 81.52,17.91 v81.52,16.44 81.52,15.05 C24.2 C21.2 81.36,12.82 v81.36,11.13 | 81.69,25.61 C27.P$2 | C26.2 63.2,9.72 61.71,9.72 61.32,9.34 v61.32,8.39 61.32,5.21 C28.- 61.69,4.96 | U2.GND 6.12,23.69 C17.2 6.12,16.75 v6,16.57 | 16.76,24.09 16.89,23.96 16.89,21.81 17.2,21.5 20.85,21.5 21,21.35 21,19.94 C10.2 | 87.86,5.12 C15.2 | 20.95,19.57 C10.2 | 16.01,9.54 16.01,7.76 v16,7.75 | C14.2 9.6,13.41 v9.52,13.34 | PW.2 19.29,3.82 19.68,3.43 21.76,3.43 C16.2 21.8,2.3 21.16,1.66 v19.32,1.66 | v40.85,8.4 42.44,8.4 C7.2 | C27.P$2 82.28,25.24 81.64,25.54 | v79.14,20.09 77.7,20.09 R18.2 | X2.GND 10.84,5.53 | 10.84,5.53 C19.- | v11.21,3.66 11.21,5.15 10.84,5.53 | QG1.2 60.13,19.87 60.64,19.36 v60.64,18.17 | C29.2 75.12,30.13 v75.06,30.28 | v81.68,27.08 81.68,25.58 C27.P$2 | v33.39,23.46 v32.18,23.46 | v32.18,23.46 | v32.19,22.04 v32.19,23.46 v32.18,23.46 | C10.2 19.68,19.92 v19.22,20.39 v16.65,20.39 | v13.3,16.81 C18.-
  Top 1.016: 83.28,5.27 v83.16,5.29
  Top 1.27: J2.GND 99.25,4.89 97.79,3.43 88.5,3.43 87.86,4.06 87.86,5.12 | C15.2 83.28,5.27
  other vias: 75.9,12.41 17.96,20.39 85.98,5.31 43.4,32.14 25.62,31.84 67.78,10.51 72.23,3.27 24.22,31.84 44.87,32.14 11.24,1.65 84.96,1.74 93.82,13.62 17.15,3.85 20.92,29.64 19.02,29.64 10.92,32.14 10.92,30.14 31.52,32.24 32.92,32.24 84.58,5.31
  pour GND (isolate 0.254): -0.4,34.31 -0.4,-0.29 103.1,-0.29 103.1,34.31
  pour Bottom (isolate 0.254): -0.4,34.28 -0.4,-0.33 103.1,-0.29 103.1,34.31
LED_ACT  (via drill 0.3)
  Top 0.254: IC2.26 75.52,19.73 v75.18,20.07
  Bottom 0.254: J1.11 96.83,27.01 96.27,26.45 91.92,26.45 89.26,29.1 83.1,29.1 82.6,28.6 80.49,28.6 75.18,23.3 | v75.18,20.07 75.18,23.3 | 75.18,23.3 75.2,23.3
LED_LINK  (via drill 0.3)
  Top 0.254: v79.25,25.05 79.25,21.84 78.74,21.34 75.18,21.34 74.52,20.67 IC2.28
  Bottom 0.254: J1.10 97.96,19.42 88.68,28.7 83.4,28.7 82.8,28.1 80.9,28.1 79.2,26.4 79.2,25.09 v79.25,25.05
N$1
  Top 0.254: Q1.3 32.47,15.63 32.47,14.47 32.78,14.15 35.48,14.15 35.96,14.63 35.96,16.06 36.66,16.75 38.56,16.75 38.93,17.12 IC1.39
  Top 0.813: C2.1 32.47,15.95 Q1.3
N$2
  Top 0.254: Q1.1 34.78,13.29 35.17,13.68 35.64,13.68 36.44,14.47 36.44,15.9 36.88,16.34 38.95,16.34 39.23,16.62 IC1.40
  Top 0.61: C1.1 34.75,11.28 Q1.1
N$3  (via drill 0.3 pad 0.25)
  Top 0.254: IC1.15 52.86,19.62 v53.1,19.87
  Bottom 0.254: v53.1,19.87 54.85,21.61 ANALOG.2 56.19,28.38 71.3,28.38 ICSP.5
N$4  (via drill 0.3 pad 0.25)
  Top 0.254: IC1.16 51.76,20.59 v52.31,21.14 | v53.52,28.38 56.06,28.38 ANALOG.1 60.51,29.71 61.8,31 68.8,31 ICSP.4
  Bottom 0.254: v53.52,28.38 53.42,28.28 53.42,22.25 52.5,21.33 v52.31,21.14
N$5
  GND 0.127: 96.87,7.02 arc-90 99.06,9.24 99.38,9.24 arc-90 101.6,6.92 arc-90 99.35,4.51 99.19,4.51 arc-90 96.87,6.76
N$6  (via drill 0.3)
  Top 0.254: IC1.7 53.38,15.62 54.79,14.21 54.79,12.08 54.94,11.93 S1.2 56.91,11.93 v57.39,12.4 | v57.39,12.4 57.39,13.94 R9.1 | v57.39,12.4 57.39,14.79 58.3,15.7 59.5,15.7 60.1,16.3 60.1,17.2 59,18.3 59,27.5 59.8,28.3 61.06,28.3 ICSP.1
N$7
  Top 0.254: IC1.56 45.71,8.66 45.17,8.12 43.95,8.12 C7.1
N$8
  Top 0.254: S2.2 54.06,27.01 R8.1
N$9
  Top 0.254: R18.1 77.55,17.04 IC2.24
N$10
  Top 0.254: IC1.19 48.71,23.25 49.45,23.99 R6.2
N$11
  Top 0.254: IC1.53 44.21,9.64 43.96,9.39 43.95,9.4 40.1,9.4 39.26,8.56 R5.1
N$12  (via drill 0.3 pad 0.25)
  Top 0.254: IC1.8 49.86,16.12 v49.14,15.26 | R7.2 v28.17,19.9
  Bottom 0.254: v49.14,15.26 42.63,15.26 41.93,14.56 38.59,14.56 36.75,12.72 36.75,11.45 36.12,10.82 36.12,8.6 35.96,8.44 35.17,8.44 34.69,7.96 30.72,7.96 30.09,7.33 29.61,7.33 28.18,8.75 28.18,15.42 28.18,17.03 v28.17,19.9
N$13  (via drill 0.3, 0.3 pad 0.51)
  Top 0.254: IC1.42 41.4,15.62 41.99,16.21 42.56,16.21 v43.1,16.75 | R3.2 36.51,27.07 36.24,27.07 36.23,27.08 35.84,27.08 35.67,26.91 35.67,23.84 35.02,23.19 v35.02,22.85
  Bottom 0.254: v43.1,16.75 43.1,17.01 38.34,21.77 36.12,21.77 36.08,21.8 v35.02,22.85
N$14  (via drill 0.3, 0.3 pad 0.51)
  Top 0.254: IC1.43 41.7,15.12 42.31,15.74 43.58,15.74 v43.9,16.06 | R4.2 40.22,27.16 40.22,27.92 39.74,28.4 35.81,28.4 35.18,27.76 35.18,24.08 34.16,23.06 v34.16,20.99
  Bottom 0.254: v43.9,16.06 42.63,16.06 42.31,16.37 42.31,17.17 38.18,21.3 35.96,21.3 35.64,20.98 v34.16,20.99
N$15
  Top 0.254: R3.1 LED1.A
N$16
  Top 0.254: R4.1 LED2.A
N$17  (via drill 0.3)
  Top 0.254: v53.9,18.6 53.9,19.71 S2.1 | IC1.44 41.99,14.62 42.63,15.26 44.22,15.26 v44.91,15.96
  Bottom 0.254: v53.9,18.6 52.79,17.48 50.25,17.48 48.72,15.96 v44.91,15.96
N$18  (via drill 0.3 pad 0.25)
  Top 0.254: IC1.14 50.67,19.12 50.25,19.55 50.25,20.34 v51.52,21.61
  Bottom 0.254: ANALOG.3 52.31,22.41 v51.52,21.61
N$19  (via drill 0.3 pad 0.25)
  Top 0.254: IC1.13 50.1,18.62 v49.77,18.95
  Bottom 0.254: v49.77,18.95 49.77,28.6 ANALOG.4
N$20  (via drill 0.3 pad 0.25)
  Top 0.254: IC1.12 49.44,18.12 v49.11,18.45
  Bottom 0.254: v49.11,18.45 49.11,28.46 47.87,29.71 ANALOG.5
N$21  (via drill 0.3 pad 0.25)
  Top 0.254: IC1.11 v48.46,17.62 v48.45,17.63
  Bottom 0.254: v48.45,17.63 48.45,28.17 48.25,28.38 46.66,28.38 45.46,29.57 45.46,29.63 44.77,29.63 ANALOG.6
N$22  (via drill 0.3 pad 0.25)
  Top 0.254: ANALOG.7 43.48,31.04 50.34,31.04 51.04,30.34 51.04,28.18 v50.98,28.12 | IC1.17 49.71,23.26 49.9,23.45 50.44,23.45 v50.47,23.42
  Bottom 0.254: v50.47,23.42 50.98,23.93 v50.98,28.12
N$23  (via drill 0.3 pad 0.25)
  Top 0.254: IC1.18 49.21,20.9 49.45,20.66 49.77,20.66 50.56,21.45 v50.56,22.25
  Bottom 0.254: ANALOG.8 40.95,31.04 50.34,31.04 51.04,30.34 51.04,29.07 51.68,28.44 51.68,23.36 v50.56,22.25
N$24  (via drill 0.3 pad 0.25)
  Top 0.254: IC1.21 v47.71,25.42
  Bottom 0.254: ANALOG.9 37.71,29.71 39.04,28.38 45.71,28.38 46.28,27.8 47.55,27.8 47.71,27.64 47.71,26.38 v47.71,25.42
N$25  (via drill 0.3 pad 0.25)
  Top 0.254: IC1.22 47.21,20.84 v47.77,20.28
  Bottom 0.254: v47.77,20.28 47.77,24.41 44.37,27.8 37.04,27.8 35.13,29.71 ANALOG.10
N$26  (via drill 0.3 pad 0.25)
  Top 0.254: IC1.23 46.71,19.75 v47.07,19.39
  Bottom 0.254: v47.07,19.39 47.07,24.31 44.06,27.33 36.91,27.33 35.87,28.38 33.96,28.38 32.63,29.71 ANALOG.11
N$27
  Top 0.254: IC1.24 46.21,23.1 47.01,23.9 47.01,25.68 47.71,26.38 47.71,27.64 46.98,28.38 41.58,28.38 40.88,29.07 40.88,30.34 40.18,31.04 30.79,31.04 ANALOG.12
N$28  (via drill 0.3 pad 0.25)
  Top 0.254: IC1.27 44.71,20.96 v45.39,20.28
  Bottom 0.254: v45.39,20.28 45.39,25.2 43.74,26.85 36.66,26.85 35.61,27.9 33.83,27.9 33.36,28.38 28.88,28.38 27.55,29.71 ANALOG.13
N$29  (via drill 0.3 pad 0.25)
  Top 0.254: IC1.28 44.21,20.03 v44.69,19.55
  Bottom 0.254: ANALOG.14 25.01,29.71 26.75,27.96 33.07,27.96 33.64,27.39 35.36,27.39 36.37,26.38 43.42,26.38 44.69,25.11 v44.69,19.55
N$30
  Top 0.254: IC1.4 52.66,14.12 52.95,13.83 52.95,4.94 SPI2.1
N$31
  Top 0.254: IC1.5 52.95,14.62 53.58,13.99 53.58,5.26 54.53,4.31 SPI2.2
N$32
  Top 0.254: IC1.6 53.24,15.12 54.22,14.15 54.22,5.9 54.53,5.64 55.49,5.64 56.76,4.31 SPI2.3
N$33  (via drill 0.3 pad 0.25)
  Top 0.254: IC1.31 42.71,21.05 43.26,20.5 43.26,19.39 44.53,18.12 46.28,18.12 46.6,17.8 46.6,13.83 45.48,12.72 v44.85,12.72
  Bottom 0.254: v44.85,12.72 48.5,12.72 48.82,12.4 48.82,5.9 SPI4.2
N$34  (via drill 0.3 pad 0.25)
  Top 0.254: IC1.32 42.21,20.92 42.79,20.34 42.79,19.23 44.37,17.64 45.96,17.64 46.12,17.48 46.12,14.31 v45.33,13.52
  Bottom 0.254: v45.33,13.52 48.82,13.52 49.3,13.04 49.3,4.79 SPI4.3
N$35  (via drill 0.3, 0.3 pad 0.25)
  Top 0.254: SPI4.1 44.69,4.79 43.83,5.64 41.13,5.64 v40.88,5.9 | v45.64,12.02 47.07,13.45 47.07,17.9 46.37,18.6 44.69,18.6 43.71,19.58 IC1.29
  Bottom 0.254: v45.64,12.02 45.64,8.44 45.33,8.12 41.99,8.12 40.88,7.01 v40.88,5.9
N$36  (via drill 0.3 pad 0.25)
  Top 0.254: IC1.46 42.26,13.62 42.95,14.31 44.22,14.31 v44.53,13.99
  Bottom 0.254: PWM.1 25.01,4.31 26.91,6.21 30.72,6.21 31.52,7.01 35.17,7.01 35.64,7.48 36.75,7.48 37.07,7.8 37.07,10.5 37.71,11.13 37.71,12.4 38.98,13.68 42.31,13.68 42.95,14.31 44.22,14.31 v44.53,13.99
N$37  (via drill 0.3 pad 0.25)
  Top 0.254: IC1.47 39.22,13.12 38.98,12.88 38.98,12.09 39.67,11.39 v39.83,11.39
  Bottom 0.254: DI/O.1 35.17,4.31 36.5,5.64 37.45,5.64 38.34,6.53 38.66,6.53 38.98,6.85 38.98,9.87 39.83,10.72 v39.83,11.39
N$38  (via drill 0.3 pad 0.25)
  Top 0.254: IC1.50 42.71,13.12 v43.1,13.52
  Bottom 0.254: PWM.2 27.55,4.31 28.88,5.64 30.79,5.64 31.67,6.53 35.33,6.53 35.8,7.01 36.91,7.01 37.55,7.64 37.55,10.34 38.18,10.98 38.18,12.25 39.13,13.2 42.79,13.2 v43.1,13.52
N$39  (via drill 0.3 pad 0.25)
  Top 0.254: IC1.51 43.21,12.35 v44.06,13.2
  Bottom 0.254: PWM.3 30.09,4.31 31.42,5.64 32.69,5.64 33.1,6.05 35.48,6.05 35.96,6.53 37.07,6.53 38.02,7.48 38.02,10.18 38.66,10.82 38.66,12.09 39.29,12.72 43.58,12.72 v44.06,13.2 | v44.06,13.2
N$40  (via drill 0.3 pad 0.25)
  Top 0.254: IC1.52 43.71,11.58 v44.22,12.09
  Bottom 0.254: v44.22,12.09 39.29,12.09 39.13,11.93 39.13,10.66 38.5,10.02 38.5,7.33 37.23,6.05 36.12,6.05 35.71,5.64 33.33,5.64 PWM.4
N$41  (via drill 0.3 pad 0.25)
  Top 0.254: IC1.48 40.16,12.1 v40.88,11.39
  Bottom 0.254: v40.88,11.39 40.31,10.82 40.31,10.4 39.45,9.55 39.45,6.37 39.13,6.05 38.66,6.05 37.71,5.1 37.71,4.94 DI/O.2
N$42  (via drill 0.3 pad 0.25)
  Top 0.254: IC1.58 46.71,9.43 v46.91,9.23
  Bottom 0.254: DI/O.3 40.25,4.31 41.58,5.64 42.85,5.64 43.42,6.21 45.64,6.21 46.28,6.85 46.28,8.6 v46.91,9.23 | v46.91,9.23
N$43  (via drill 0.3 pad 0.25)
  Top 0.254: IC1.59 47.21,11.91 47.33,12.02 v48.15,12.02
  Bottom 0.254: DI/O.4 43.48,5.64 47.3,5.64 48.26,6.61 48.26,8.51 48.15,8.62 v48.15,12.02
N$44
  Bottom 0.127: 96.87,7.02 arc-90 99.06,9.24 99.31,9.24 arc-90 101.6,6.86 arc-90 99.35,4.51
N$45
  Bottom 0.127: 99.06,4.51 arc-90 96.87,6.76
N$46
  Top 0.051: 15.3,12.83 15.43,12.83 15.62,12.64 | 15.62,12.64 15.68,12.57 | 15.62,12.57 15.62,12.64
N$47  (via drill 0.3)
  Top 0.254: R17.1 78.03,5.99 v78.35,6.31 | IC2.21 74.36,15.4 v74.35,15.39
  Bottom 0.254: v78.35,6.31 78.35,6.37 78.03,6.69 76.12,6.69 74.54,8.28 74.54,11.45 73.27,12.72 73.27,14.31 v74.35,15.39
N$48  (via drill 0.3)
  Top 0.254: IC2.20 75.32,14.9 v74.98,14.63 | R16.1 v78.98,8.06
  Bottom 0.254: v74.98,14.63 74.66,14.31 74.06,14.31 73.74,13.99 73.74,12.88 75.17,11.45 75.17,8.6 75.97,7.8 78.73,7.8 v78.98,8.06
N$49
  Top 0.254: IC2.39 R19.2
N$50
  Top 0.051: 15.62,12.26 15.05,11.68 14.86,11.68 | 15.62,12.26 15.68,12.32 | 15.68,12.32 15.75,12.38 | 15.62,12.26 15.62,12.32 | 15.56,12.32 15.68,12.32
N$51
  Top 0.064: 17.4,10.54 17.4,10.73 | 17.4,10.73 17.4,10.86 | 17.4,10.86 17.4,10.92 | 17.4,10.86 17.21,11.05 | 17.4,10.73 17.08,11.05
N$52
  Top 0.254: R15.2 69.35,10.24 70.25,11.13 71.84,11.13 72.02,10.96 IC2.4
N$53  (via drill 0.3)
  Top 0.254: R14.2 v70.41,6.53 | IC2.3 71.52,7.33 v71.68,7.17
  Bottom 0.254: v70.41,6.53 71.04,6.53 v71.68,7.17
N$54
  Top 0.254: 70.41,4.31 70.41,5.26 71.12,5.97 71.12,6.79 71.02,6.9 IC2.2
  Top 0.406: 70.41,4.31 R13.2
N$55
  Top 0.254: R26.2 99.74,16.76 J1.9
N$56
  Top 0.254: R20.2 66.6,13.83 66.76,13.68 67.71,13.68 67.94,13.9 IC2.43
N$57
  Top 0.254: R21.2 65.96,11.45 66.12,11.61 66.38,11.61 68.17,13.4 IC2.44
N$58
  Top 0.254: R10.1 67.11,19.01 66.98,19.14 66.98,19.9 66.62,20.26 QG1.3
N$59
  Top 0.064: 17.46,10.67 17.46,10.79 | 17.46,10.79 17.46,10.86 | 17.46,10.79 17.4,10.79 17.14,11.05
N$60
  Top 0.064: 17.97,10.79 17.53,11.24 17.34,11.24
N$61
  Top 0.254: IC3.4 22.24,14.06 R2.2
N$62
  Top 0.254: J1.12 98.33,32.83 R27.2
N$63
  Top 0.064: 17.84,10.86 17.53,11.18 17.46,11.18 | 17.46,11.18 17.4,11.18 | 17.78,10.86 17.46,11.18
N$64
  Top 0.064: 17.53,12.32 17.08,11.87 17.14,11.87 17.46,12.19 17.46,12.13 17.27,11.94 17.34,11.94 17.46,12.06 17.46,12 17.4,11.94 17.46,11.94
N$65
  Top 0.064: 17.53,11.75 17.84,11.75
N$66
  Top 0.064: 17.02,11.68 17.78,11.68 17.84,11.68 | 17.84,11.68 18.1,11.94 18.1,11.87 17.91,11.68 17.84,11.68
N$67
  GND 0.127: 6.57,25.05 6.57,25.18 6.19,25.56 4.79,25.56 4.19,24.96 4.19,23.78 4.95,23.02 6.1,23.02 6.6,23.53
N$68
  Bottom 0.127: 20.6,4.1 20.6,4.9 19.9,5.6 18.7,5.6 18,4.9 18,3.6 18.6,3 19.9,3
N$69
  GND 0.127: 5.17,5.57 arc-90 6.06,6.56 6.19,6.56 arc-90 7.21,5.57 7.21,5.51 arc-90 6.16,4.53 arc-90 5.17,5.51
N$70
  Bottom 0.127: 5.17,5.54 arc-90 6.1,6.56 6.22,6.56 arc-90 7.21,5.57 7.21,5.48 arc-90 6.16,4.53 arc-90 5.17,5.51
N$71
  Bottom 0.127: 6.6,23.5 6.1,23 5,23 4.2,23.8 4.2,25 4.8,25.6 6.2,25.6 6.6,25.2 6.6,25.1
N$72
  GND 0.127: 20.6,4.1 20.6,4.9 19.9,5.6 18.7,5.6 18,4.9 18,3.6 18.6,3 19.9,3
PFBOUT
  Top 0.254: C23.1 68.66,17.96 69.14,17.48 69.14,16.92 IC2.37 70.83,16.9 71.81,15.93 73.52,15.93 | 73.52,15.93 73.58,15.93 73.58,15.04 74.73,13.9 75.01,13.9 75.39,13.52 76,13.52 76.38,13.9 IC2.18 78.34,13.9 78.89,13.36 79.24,13.36 C21.1 | 73.52,15.93 74.73,17.14 75.78,17.14 76.51,16.4 IC2.23 78.37,16.4 78.82,16.85 78.82,17.8 78.98,17.96 C22.1
  Top 0.813: 81.03,20.99 C27.P$1 81.73,20.89 81.73,19.76 81.37,19.4 80.11,19.4 79.88,19.17 C22.1
RDM  (via drill 0.3)
  Top 0.254: IC2.13 77.42,10.79 v78.03,10.18 | J1.6 86.06,25.24 83.2,28.1 80.8,28.1 78.2,25.5 71.9,25.5 71.4,26 71.4,26.82 R25.1
  Bottom 0.254: J1.6 86.06,24.47 84.16,22.57 84.16,16.85 83.2,15.9 83.2,14.31 82.73,13.83 82.73,10.82 82.09,10.18 v78.03,10.18
RDP  (via drill 0.3)
  Top 0.254: IC2.14 76.38,11.9 76.12,11.64 76.12,11.29 76.89,10.53 v76.89,9.77 | J1.3 87.33,22.57 87.33,25.67 86.6,26.4 85.7,26.4 83.5,28.6 78.88,28.6 R24.1
  Bottom 0.254: J1.3 87.33,20.02 87.33,19.23 83.84,15.74 83.84,11.1 82.22,9.48 77.52,9.48 77.23,9.77 v76.89,9.77
SELF  (via drill 0.3 pad 0.25, 0.6 pad 1.27)
  Top 0.254: IC3.2 v20.2,11.81 v20.19,11.81 | 21.8,8.26 R1.2 | C16.1 22.86,5.08 23.43,5.65 28.13,5.65 29.34,6.86 30.27,6.86 R5.2 | C13.1 | v20.45,10.16 19.56,10.16 19.43,10.03 19.43,9.4 | IC3.8 17.29,11.16 17.78,10.67 17.78,10.48
  Top 0.406: R1.2 v21.84,6.86
  Top 0.61: C16.1
  Top 0.813: 21.8,8.26 20.7,8.26 19.56,9.4 19.43,9.4 17.79,9.4 C13.1 | C13.1 17.78,10.48
  Top 1.016: C16.1 21.84,6.01 v21.84,6.86 v21.84,6.85 PW.1
  Top 1.27: J2.PWR 91.8,6.97 C15.1 81.01,6.97 78.11,4.06 78.11,2.29 77.47,1.65 v23.19,1.65
  Bottom 0.254: v20.19,11.81 20.19,10.41 v20.45,10.16
  Bottom 1.016: v23.2,1.65 v23.19,1.65
  Bottom 1.27: v21.84,6.86 21.84,2.26 22.45,1.65 v23.2,1.65
TDM
  Top 0.254: 85.74,12.67 R23.1 85.64,12.82 85.58,12.88 85.58,17.8 | IC2.16 78.48,12.9 78.66,12.72 78.66,10.98 79.46,10.18 81.93,10.18 82.73,10.98 82.73,13.83 83.2,14.31 83.2,15.9 85.11,17.8 85.58,17.8 | J1.2 86.06,17.96 85.9,17.8 85.58,17.8
TDP  (via drill 0.3)
  Top 0.254: IC2.17 76.45,13.4 76.16,13.1 74.63,13.1 v74.54,13.2 | R22.1 88.82,18.54 J1.1
  Bottom 0.254: v74.54,13.2 74.54,12.82 76.12,11.23 76.12,9.39 76.69,8.82 84.86,8.82 87.81,11.77 87.81,18.6 87.97,18.75 J1.1
VBUS  (via drill 0.3, 0.5 pad 1.02)
  Top 0.254: IC1.34 41.27,19.62 41.52,19.87 41.52,20.18 40.88,20.82 40.09,20.82 39.61,21.3 39.61,21.77 40.25,22.41 40.25,23.14 C9.2 40.41,23.41 40.41,24.47 40.15,24.72 v39.73,24.72 | v9.78,14.86 9.65,14.99 9.65,18.8 10.78,19.93 v12.57,19.93
  Top 0.813: F1.2 10.45,15.53 v9.78,14.86 | X2.VBUS 7.47,12.53 9.3,10.7 11.21,10.7 C19.+ 14.34,10.71 v14.48,10.85
  Bottom 0.254: v39.73,24.72 39.62,24.83 36.92,24.83 36.53,24.45 31.28,24.45 28.34,21.5 13.75,21.5 12.57,20.32 v12.57,19.93
  Bottom 0.813: v9.78,14.86 9.78,14.82 13.7,10.9 14.42,10.9 v14.48,10.85
VBUS_DEVICE  (via drill 0.3, 0.5 pad 0.81, 0.5 pad 1.02)
  Top 0.254: 13.53,13.37 C14.1 | IC3.6 15.38,12.46 15.24,12.45 | R7.1 24.95,19.93 v24.25,19.93 | 7.56,24.38 U2.VBUS
  Top 0.813: U2.VBUS 7.82,23.97 C17.1 7.82,16.73 v7.84,16.7 | 13.53,13.37 13.53,12.32 13.78,12.06 14.86,12.06 15.24,12.45 | v13.37,14.95 13.37,13.42 C14.1
  Bottom 0.254: 9.65,16.7 9.68,16.73 9.68,18.13 10.8,19.25 23.57,19.25 v24.25,19.93
  Bottom 0.813: v7.84,16.7 9.65,16.7 10.29,16.7 11.94,15.05 13.27,15.05 v13.37,14.95
VCC
  Top 0.254: 19.43,16.49 C18.+ | IC3.7 17.52,11.81 17.84,12.13
  Top 0.406: 22.58,18.39 22.58,18.59 22.58,18.67 22.61,18.67
  Top 0.813: IC4.1 22.66,19.94 C10.1 22.61,19.85 22.61,18.67 | F1.1 11.71,18.29 19.6,18.29 | 19.43,16.49 19.43,15.3 18.1,13.97 18.1,12.38 17.84,12.13 | 5V.4 5V.3 5V.2 5V.1 25.43,18.59 22.58,18.59 22.28,18.29 19.6,18.29 | C18.+ 19.45,18.14 19.6,18.29
VDD  (via drill 0.3, 0.3 pad 0.6, 0.5, 0.5 pad 0.81, 0.5 pad 1.02)
  Top 0.254: IC1.26 45.21,25.05 C4.1 | C3.1 54.2,17.12 53.68,17.64 53.26,17.64 52.74,17.12 IC1.10 49.09,17.12 48.34,16.37 48.34,13.68 46.21,11.54 IC1.57 46.21,7.18 C6.1 | R8.2 56.18,23.2 53.42,23.2 | C25.1 71.04,20.66 | IC2.22 75.72,15.9 v75.33,16.28 | IC2.22 | IC2.48 67.34,11.4 65.96,10.02 65.23,10.02 C26.1 | v72.47,16.85 72.52,17.01 IC2.32 72.52,19.37 72.07,19.81 72.07,20.77 71.94,20.89 71.07,20.89 C25.1 | IC2.22 78.34,15.9 78.82,15.42 79.24,15.42 C24.1 | IC1.35 39.24,19.12 38.98,19.39 38.98,20.82 38.66,21.14 37.76,21.14 C8.1 | IC1.38 39.25,17.62 38.99,17.89 38.99,18.16 38.66,18.49 38.66,18.91 38.5,19.07 37.76,19.07 C5.1 | R6.1 50.98,26.75 51.68,26.06 51.68,24.31 52.79,23.2 53.42,23.2 | 53.42,23.2 | 71.06,20.91 C25.1
  Top 0.406: 87.17,10.82 87.12,10.82 C30.1
  Top 0.61: C3.1 55.11,15.16 55.8,14.47 55.8,14.05 R9.2 | v36.28,22.88 37.07,22.88 37.55,22.41 37.55,21.35 C8.1 | R16.2 76.23,7.3 76,7.07 75.62,7.07 75.49,6.94 75.49,6.02 R17.2 | C20.1 67.87,25.43 67.6,25.7 65.25,25.7 QG1.4
  Top 0.813: C5.1 C8.1 37.55,20.72 37.55,21.61 | v43.48,25.05 C4.1 | C6.1 v42.47,6.69 | R12.2 v73.42,5.26 | R19.1 v60.88,15.9 | C30.1 R22.2 | R23.2 83.94,11.71 v84.95,10.82 87.17,10.82 | C3.1 55.11,17.59 v55.65,18.12 | R8.2 57.39,27.01 v57.55,27.17 | v67.23,4.94 C28.+ | v79.78,16.37 79.78,15 C24.1 | IC4.2 24.85,27.07 C11.1 24.87,26.94 25.07,27.01 28.34,27.01 C12.+ 28.64,26.8 v31.72,26.8 31.71,26.81 | C20.1 67.94,24.47 69.53,24.47 | R17.2 75.39,5.99 v75.39,4.34 | 64.48,4.97 C28.+ | R26.1 96.59,13.52 v96.58,13.53 | R27.1 v95.26,32.85 v95.25,32.86 | C26.1 64.91,5.19 C28.+ | 65,25.95 QG1.4 | R25.2 73.06,26.82 C29.1 76.53,26.78 v77.02,26.8 77.02,28.5 R24.2 | 69.53,24.47 v69.56,24.5 | 69.53,24.47 72.23,24.47 72.4,24.3 73.73,24.3 R11.1 | 31.71,26.81 32.33,26.81 v32.88,26.26 v34.17,26.26 | 31.48,26.81 31.71,26.81
  pour VDD (isolate 0.254): 103.13,34.31 18.29,34.31 18.29,23.41 24.03,23.41 24.57,22.86 28.22,19.21 28.18,7.64 23.1,7.64 23.1,3.04 77.11,2.91 77.11,4.15 80.76,7.8 89.24,7.8 91.94,10.5 103.13,10.5

### Text on the board
tNames: v1.0 | tkrworks | PICrouter | CC by-SA 3.0 | SW1 | RESET | 5Vin | GND | 5Vin
tValues: HOST